# Altium schematic sheet ATCBUS.SchDoc
size A
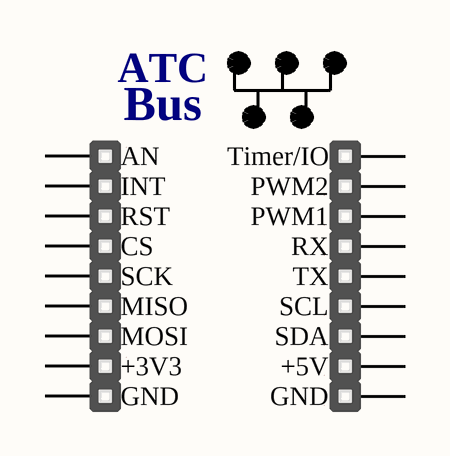
[diagram p0: ATCBUS.SchDoc]

## Parts
?  ATCBUS  [ATCBus - basic]  (value not drawn)

## Nets

Not connected (* = marked no-connect by the designer): ? 1(AN) 2(INT) 3(RST) 4(CS) 5(SCK) 6(MISO) 7(MOSI) 8(+3V3) 9(GND) 10(GND) 11(+5V) 12(SDA) 13(SCL) 14(TX) 15(RX) 16(PWM1) 17(PWM2) 18(Timer/IO)

## Notes on the sheet
- (in symbol ATCBUS) ATC; Bus

## Library data of the parts
? = ATCBUS: 2.54mm 40x1 Single Male Pin Header (Gold); Part number: 2.54mm-40x1-MH; Manufacturer: Taiwan; Part name: 2.54mm-40x1-Male Header; Package: SIP40